# EAGLE design labwiz-module_full_breakout-0.2 (EAGLE 6.5.0)

## Sheet 1 of 2
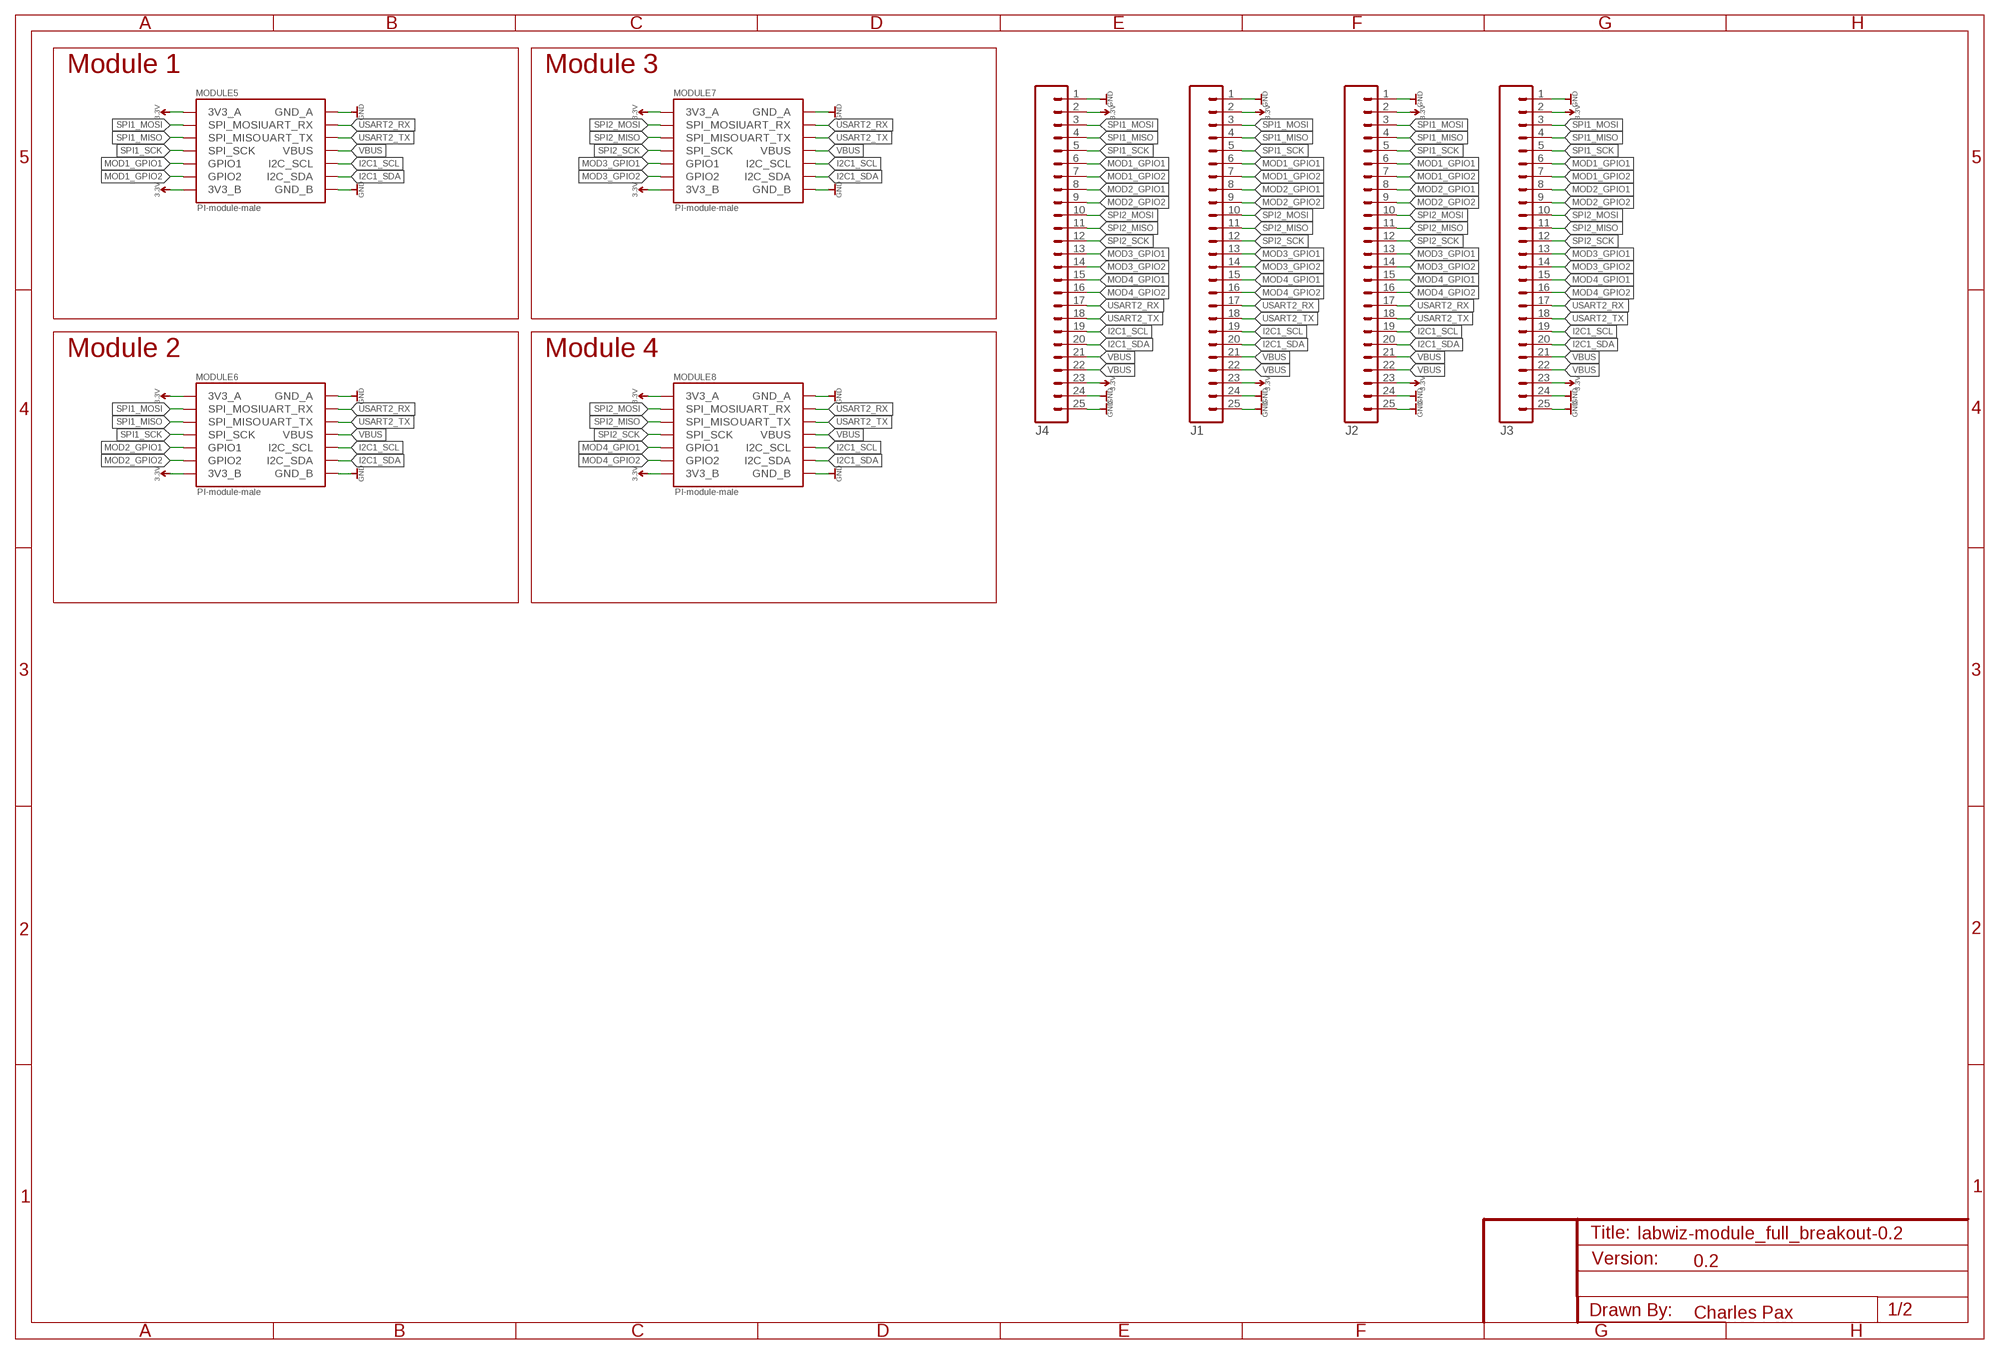
[diagram p0: schematic, sheet 1]

### Parts
J1  M25PTH  [1X25]
J2  M25PTH  [1X25]
J3  M25PTH  [1X25]
J4  M25PTH  [1X25]
MODULE5  PI-module-male  PAX_MODULE_EDGE_MALE_MODULE  [M07X2_2MM_EDGE]
MODULE6  PI-module-male  PAX_MODULE_EDGE_MALE_MODULE  [M07X2_2MM_EDGE]
MODULE7  PI-module-male  PAX_MODULE_EDGE_MALE_MODULE  [M07X2_2MM_EDGE]
MODULE8  PI-module-male  PAX_MODULE_EDGE_MALE_MODULE  [M07X2_2MM_EDGE]

### Nets
3.3V: J1.2 J1.23 J2.2 J2.23 J3.2 J3.23 J4.2 J4.23 MODULE5.P$1(3V3_B) MODULE5.P$13(3V3_A) MODULE6.P$1(3V3_B) MODULE6.P$13(3V3_A) MODULE7.P$1(3V3_B) MODULE7.P$13(3V3_A) MODULE8.P$1(3V3_B) MODULE8.P$13(3V3_A)
GND: J1.1 J1.24 J1.25 J2.1 J2.24 J2.25 J3.1 J3.24 J3.25 J4.1 J4.24 J4.25 MODULE5.P$2(GND_B) MODULE5.P$14(GND_A) MODULE6.P$2(GND_B) MODULE6.P$14(GND_A) MODULE7.P$2(GND_B) MODULE7.P$14(GND_A) MODULE8.P$2(GND_B) MODULE8.P$14(GND_A)
I2C1_SCL: J1.19 J2.19 J3.19 J4.19 MODULE5.P$6(I2C_SCL) MODULE6.P$6(I2C_SCL) MODULE7.P$6(I2C_SCL) MODULE8.P$6(I2C_SCL)
I2C1_SDA: J1.20 J2.20 J3.20 J4.20 MODULE5.P$4(I2C_SDA) MODULE6.P$4(I2C_SDA) MODULE7.P$4(I2C_SDA) MODULE8.P$4(I2C_SDA)
MOD1_GPIO1: J1.6 J2.6 J3.6 J4.6 MODULE5.P$5(GPIO1)
MOD1_GPIO2: J1.7 J2.7 J3.7 J4.7 MODULE5.P$3(GPIO2)
MOD2_GPIO1: J1.8 J2.8 J3.8 J4.8 MODULE6.P$5(GPIO1)
MOD2_GPIO2: J1.9 J2.9 J3.9 J4.9 MODULE6.P$3(GPIO2)
MOD3_GPIO1: J1.13 J2.13 J3.13 J4.13 MODULE7.P$5(GPIO1)
MOD3_GPIO2: J1.14 J2.14 J3.14 J4.14 MODULE7.P$3(GPIO2)
MOD4_GPIO1: J1.15 J2.15 J3.15 J4.15 MODULE8.P$5(GPIO1)
MOD4_GPIO2: J1.16 J2.16 J3.16 J4.16 MODULE8.P$3(GPIO2)
SPI1_MISO: J1.4 J2.4 J3.4 J4.4 MODULE5.P$9(SPI_MISO) MODULE6.P$9(SPI_MISO)
SPI1_MOSI: J1.3 J2.3 J3.3 J4.3 MODULE5.P$11(SPI_MOSI) MODULE6.P$11(SPI_MOSI)
SPI1_SCK: J1.5 J2.5 J3.5 J4.5 MODULE5.P$7(SPI_SCK) MODULE6.P$7(SPI_SCK)
SPI2_MISO: J1.11 J2.11 J3.11 J4.11 MODULE7.P$9(SPI_MISO) MODULE8.P$9(SPI_MISO)
SPI2_MOSI: J1.10 J2.10 J3.10 J4.10 MODULE7.P$11(SPI_MOSI) MODULE8.P$11(SPI_MOSI)
SPI2_SCK: J1.12 J2.12 J3.12 J4.12 MODULE7.P$7(SPI_SCK) MODULE8.P$7(SPI_SCK)
USART2_RX: J1.17 J2.17 J3.17 J4.17 MODULE5.P$12(UART_RX) MODULE6.P$12(UART_RX) MODULE7.P$12(UART_RX) MODULE8.P$12(UART_RX)
USART2_TX: J1.18 J2.18 J3.18 J4.18 MODULE5.P$10(UART_TX) MODULE6.P$10(UART_TX) MODULE7.P$10(UART_TX) MODULE8.P$10(UART_TX)
VBUS: J1.21 J1.22 J2.21 J2.22 J3.21 J3.22 J4.21 J4.22 MODULE5.P$8(VBUS) MODULE6.P$8(VBUS) MODULE7.P$8(VBUS) MODULE8.P$8(VBUS)

### Notes on the sheet
- Module 1 | Module 3
- Module 2 | Module 4
- 0.2
- Charles Pax

## Sheet 2 of 2

## Library data of the parts
J1-J4 = SparkFun-Connectors:M25: 1x25 .1" header
MODULE5-MODULE8 = PaxInstruments-Connectors:PAX_MODULE; MF: Pax Instruments; MPN: PIxxxx

## Net classes
0 Digital signal: width 0.1 mm, drill 0.2 mm, clearance 0.15 mm
1 3.3V power: width 0.1 mm, drill 0.2 mm, clearance 0.15 mm
2 RTC battery: width 0.1 mm, drill 0.2 mm, clearance 0.15 mm
3 5V power: width 0.1 mm, drill 0.2 mm, clearance 0.15 mm
4 Analog signal: width 0.1 mm, drill 0.2 mm, clearance 0.15 mm
5 GND: width 0.1 mm, drill 0.2 mm, clearance 0.15 mm

## Board
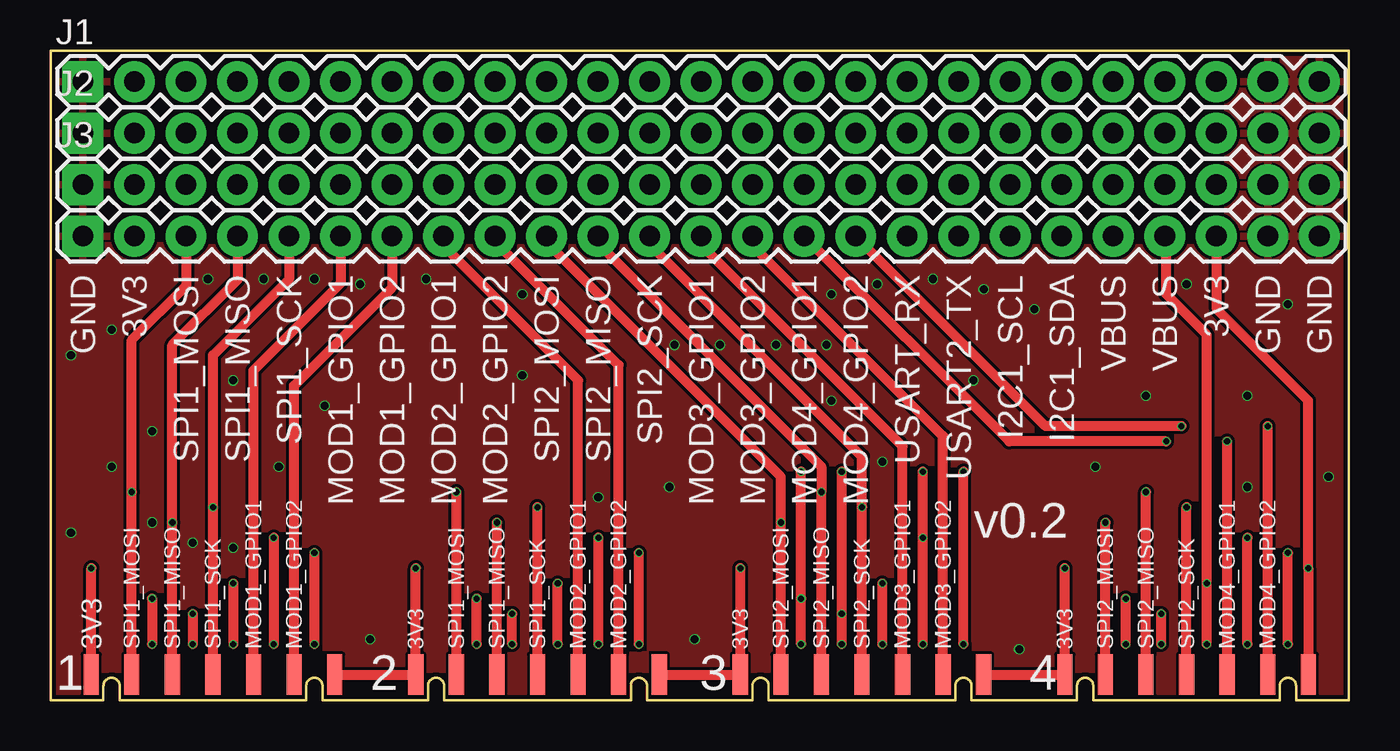
[diagram p1: board, top side]
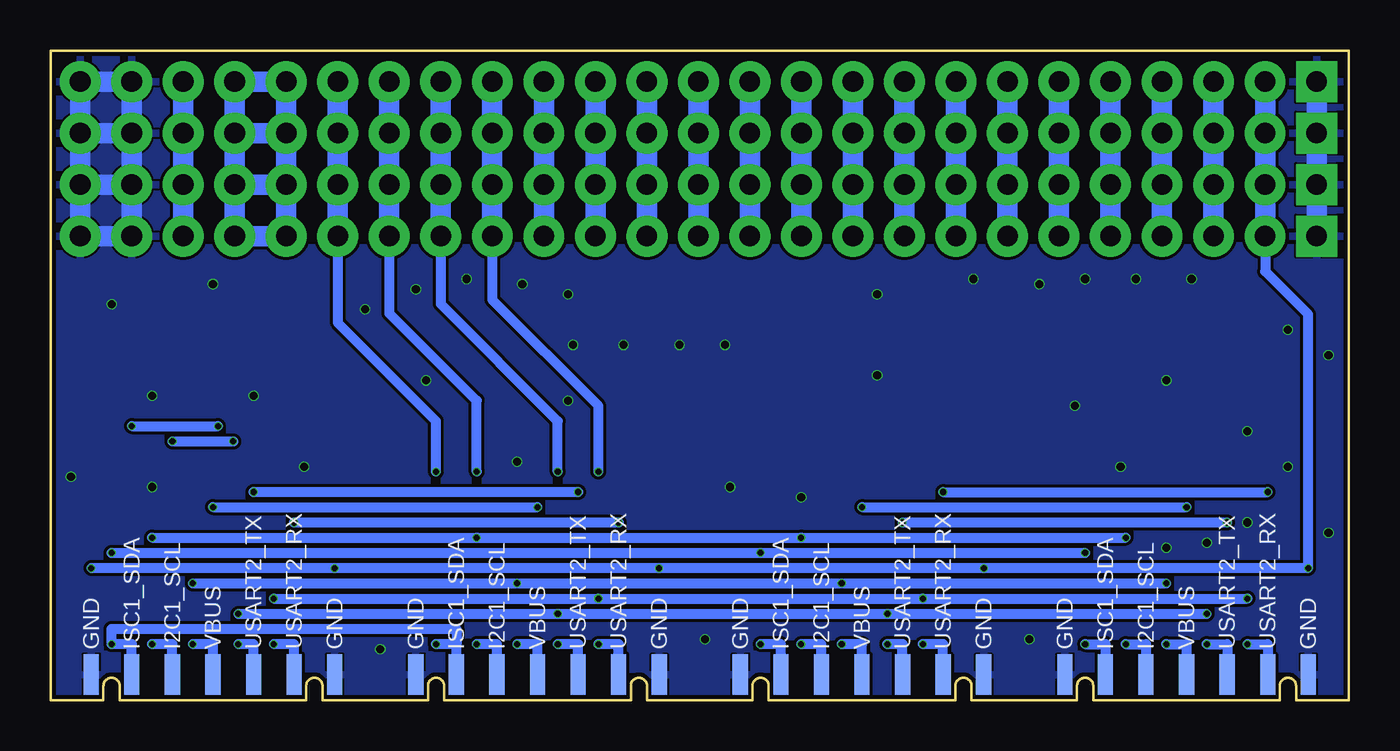
[diagram p2: board, bottom side, seen from below]

Size 64 x 32 mm. Coordinates in mm from the lower left corner, seen from the top.
Outline: 0,32 0,0 2.6,0 2.6,0.7 arc-180 3.4,0.7 3.4,0 12.6,0 12.6,0.7 arc-180 13.4,0.7 13.4,0 18.6,0 18.6,0.7 arc-180 19.4,0.7 19.4,0 28.6,0 28.6,0.7 arc-180 29.4,0.7 29.4,0 34.6,0 34.6,0.7 arc-180 35.4,0.7 35.4,0 44.6,0 44.6,0.7 arc-180 45.4,0.7 45.4,0 50.6,0 50.6,0.7 arc-180 51.4,0.7 51.4,0 60.6,0 60.6,0.7 arc-180 61.4,0.7 61.4,0 64,0 64,32 0,32
Copper layers (1*2+15*16): Top 0.017mm / dielectric 0.5mm / GND 0.017mm / dielectric 0.075mm / 3.3V 0.017mm / dielectric 0.5mm / Bottom 0.017mm
Design rules "PaxInstrument-T400 *": minimum track width 0.1mm, minimum drill 0.2mm, track to track 0.075mm, track to pad 0.075mm, pad to pad 0.075mm, via to via 0.075mm, smd to smd 0.075mm, copper to edge 0.2mm, drill to drill 0.2mm, minimum pad ring 0.5mm, minimum via ring 0.05mm, stop-mask expansion 0.01mm, vias tented up to drill 0.25mm, thermal gap 0.1mm

### Footprints (pad centres in the part's own frame; a part is rotated, then mirrored left to right if it is on the bottom)
1X25 = drill 1.016 pad 1.88 square: 1 0,0 | drill 1.016 pad 1.88: 2 2.54,0; 3 5.08,0; 4 7.62,0; 5 10.16,0; 6 12.7,0; 7 15.24,0; 8 17.78,0; 9 20.32,0; 10 22.86,0; 11 25.4,0; 12 27.94,0; 13 30.48,0; 14 33.02,0; 15 35.56,0; 16 38.1,0; 17 40.64,0; 18 43.18,0; 19 45.72,0; 20 48.26,0; 21 50.8,0; 22 53.34,0; 23 55.88,0; 24 58.42,0; 25 60.96,0
M07X2_2MM_EDGE = smd 0.75 x 2: P$1 0,-0.25; P$3 2,-0.25; P$5 4,-0.25; P$7 6,-0.25; P$9 8,-0.25; P$11 10,-0.25; P$13 12,-0.25 | smd 0.75 x 2 bottom: P$2 0,-0.25; P$4 2,-0.25; P$6 4,-0.25; P$8 6,-0.25; P$10 8,-0.25; P$12 10,-0.25; P$14 12,-0.25

### Placement (x,y rotation side)
J1  1.59,30.48 0 top
J2  1.59,27.94 0 top
J3  1.59,25.4 0 top
J4  1.59,22.86 0 top
MODULE5  14,1 180 top
MODULE6  30,1 180 top
MODULE7  46,1 180 top
MODULE8  62,1 180 top

### Tracks (layer width: path | path; a pad name or v marks a point on that pad's centre or on a via)
3.3V  (via drill 0.3)
  Top 0.5: MODULE5.P$13 v2,6.5 | MODULE8.P$1 v62,6.5 62,14.75 57.5,19.25 57.5,22.83 J4.23 | v18,6.5 MODULE6.P$13 MODULE5.P$1 | MODULE7.P$1 MODULE8.P$13 v50,6.5 | v34,6.5 MODULE7.P$13 MODULE6.P$1
  Bottom 0.5: v62,6.5 v50,6.5 v34,6.5 v18,6.5 v2,6.5 2,19 4.13,21.13 J4.2
  Bottom 1.016: J1.2 J2.2 J3.2 J4.2 | J1.23 J2.23 J3.23 J4.23
GND  (via drill 0.4)
  Bottom 1.016: J2.1 J1.1 J3.1 J4.1 | J2.25 J3.25 J3.24 J4.24 | J1.25 J4.25 J4.24 | J2.24 J1.24 | J1.24 J1.25 | J1.25 J2.25 | J2.25 J2.24 | J2.24 J4.24 | J1.24 J4.24
  other vias: 54,15 59,15 56,20.5 61,19.5 63,11 59,10.5 51.5,11.5 48.5,19.25 46,20.25 43.5,20.75 45.5,15.75 41,11.75 38.5,14.75 35.75,17.5 33,17.5 30.75,17.5 30.5,10.5 23.25,16 13.5,14.5 18.5,20.75 15.25,20.5 13,20.75 10.5,20.75 7.75,20.75 5,13.25 5,8.75 9,15.75 7,7.75 9,7.5 11.25,11.5 3,18.25 3,11.5 1,8.25 1,17 23.25,20 27,10 15.75,3 31.75,3 47.75,2.5 38.25,17.5 38.5,20 40.75,20.5
  pour Bottom: 0,32 -0.25,-0.25 64,0 64,32
  pour Top: 0,32 -0.25,-0.25 64,0 64,32
I2C1_SCL  (via drill 0.3)
  Top 0.5: v43,11.25 v43,2.75 v43,8 | v59,2.75 v59,8 | v11,8 v11,2.75 | v27,2.75 v27,8
  Bottom 0.5: MODULE7.P$6 42,2.75 v43,2.75 | v43,11.25 43,14.75 47.31,19.06 J4.19 | MODULE8.P$6 58,2.75 v59,2.75 | v59,8 v43,8 v27,8 v11,8 | v11,2.75 10,2.75 MODULE5.P$6 | MODULE6.P$6 26,2.75 v27,2.75
  Bottom 1.016: J1.19 J2.19 J3.19 J4.19
I2C1_SDA  (via drill 0.3)
  Top 0.5: v45,2.75 v45,11.25 | v61,2.75 v61,7.25 | v13,7.25 v13,2.75 | v29,2.75 v29,7.25
  Bottom 0.5: MODULE7.P$4 44,2.75 | 44,2.75 v45,2.75 | v45,11.25 45,13.75 49.85,18.6 J4.20 | MODULE8.P$4 60,2.75 v61,2.75 61,3.5 44,3.5 44,2.75 | v61,7.25 v29,7.25 v13,7.25 | v13,2.75 12,2.75 MODULE5.P$4 | MODULE6.P$4 28,2.75 v29,2.75
  Bottom 1.016: J1.20 J2.20 J3.20 J4.20
MOD1_GPIO1
  Top 0.5: MODULE5.P$5 10,16.25 14.29,20.54 J4.6
  Bottom 1.016: J3.6 J2.6 J1.6 J4.6
MOD1_GPIO2
  Top 0.5: MODULE5.P$3 12,15.5 16.83,20.33 J4.7
  Bottom 1.016: J3.7 J2.7 J1.7 J4.7
MOD2_GPIO1
  Top 0.5: MODULE6.P$5 26,15.75 19.37,22.38 J4.8
  Bottom 1.016: J3.8 J2.8 J1.8 J4.8
MOD2_GPIO2
  Top 0.5: MODULE6.P$3 28,16.5 21.91,22.59 J4.9
  Bottom 1.016: J3.9 J2.9 J1.9 J4.9
MOD3_GPIO1
  Top 0.5: MODULE7.P$5 42,12.5 32.07,22.43 J4.13
  Bottom 1.016: J1.13 J2.13 J3.13 J4.13
MOD3_GPIO2
  Top 0.5: MODULE7.P$3 44,13 34.61,22.39 J4.14
  Bottom 1.016: J3.14 J2.14 J1.14 J4.14
MOD4_GPIO1  (via drill 0.3)
  Top 0.5: MODULE8.P$5 v58,12.75 | v55,12.75 47.26,12.75 J4.15
  Bottom 0.5: v58,12.75 v55,12.75
  Bottom 1.016: J2.15 J1.15 J3.15 J4.15
MOD4_GPIO2  (via drill 0.3)
  Top 0.5: MODULE8.P$3 v60,13.5 | v55.75,13.5 49.05,13.5 J4.16
  Bottom 0.5: v60,13.5 v55.75,13.5
  Bottom 1.016: J2.16 J1.16 J3.16 J4.16
SPI1_MISO  (via drill 0.3)
  Top 0.5: MODULE5.P$9 v6,8.75 6,17.5 9.21,20.71 J4.4 | MODULE6.P$9 v22,8.75
  Bottom 0.5: v22,8.75 v6,8.75
  Bottom 1.016: J1.4 J2.4 J3.4 J4.4
SPI1_MOSI  (via drill 0.3)
  Top 0.5: MODULE5.P$11 v4,10.25 4,17.75 6.67,20.42 J4.3 | MODULE6.P$11 v20,10.25
  Bottom 0.5: v20,10.25 v4,10.25
  Bottom 1.016: J2.3 J1.3 J3.3 J4.3
SPI1_SCK  (via drill 0.3)
  Top 0.5: MODULE5.P$7 v8,9.5 8,17 11.75,20.75 J4.5 | MODULE6.P$7 v24,9.5
  Bottom 0.5: v24,9.5 v8,9.5
  Bottom 1.016: J3.5 J2.5 J1.5 J4.5
SPI2_MISO  (via drill 0.3)
  Top 0.5: MODULE7.P$9 v38,10.25 38,11.5 26.99,22.51 J4.11 | MODULE8.P$9 v54,10.25
  Bottom 0.5: v38,10.25 v54,10.25
  Bottom 1.016: J1.11 J2.11 J3.11 J4.11
SPI2_MOSI  (via drill 0.3)
  Top 0.5: MODULE7.P$11 v36,8.75 | v36,8.75 36,11 24.45,22.55 J4.10 | MODULE8.P$11 v52,8.75 | v36,8.75 36,9
  Bottom 0.5: v52,8.75 v36,8.75
  Bottom 1.016: J3.10 J2.10 J1.10 J4.10
SPI2_SCK  (via drill 0.3)
  Top 0.5: MODULE7.P$7 v40,9.5 40,12 29.53,22.47 J4.12 | MODULE8.P$7 v56,9.5
  Bottom 0.5: v56,9.5 v40,9.5
  Bottom 1.016: J1.12 J2.12 J3.12 J4.12
USART2_RX  (via drill 0.3)
  Top 0.5: v37,11.25 v37,5 v37,2.75 | v53,2.75 v53,5 | v5,5 v5,2.75 | v21,2.75 v21,5
  Bottom 0.5: MODULE7.P$12 36,2.75 v37,2.75 | v37,11.25 37,14.5 42.23,19.73 J4.17 | MODULE8.P$12 52,2.75 v53,2.75 | v53,5 v37,5 v21,5 v5,5 | v5,2.75 4,2.75 MODULE5.P$12 | MODULE6.P$12 20,2.75 v21,2.75
  Bottom 1.016: J1.17 J2.17 J3.17 J4.17
USART2_TX  (via drill 0.3)
  Top 0.5: v39,11.25 v39,2.75 v39,4.25 | v54.75,2.75 v54.75,4.25 | v7,4.25 v7,2.75 | v22.75,2.75 v22.75,4.25
  Bottom 0.5: MODULE7.P$10 38,2.75 v39,2.75 | v39,11.25 39,13.75 44.77,19.52 J4.18 | MODULE8.P$10 54,2.75 v54.75,2.75 | v54.75,4.25 v39,4.25 v22.75,4.25 v7,4.25 | v7,2.75 6,2.75 MODULE5.P$10 | MODULE6.P$10 22,2.75 v22.75,2.75
  Bottom 1.016: J1.18 J2.18 J3.18 J4.18
VBUS  (via drill 0.3)
  Top 0.5: v57,2.75 v57,5.75 57,18 55,20 55,22.79 J4.22 | v9,5.75 v9,2.75 | v25,2.75 v25,5.75 | v41,2.75 v41,5.75
  Bottom 0.5: MODULE8.P$8 56,2.75 v57,2.75 | v57,5.75 v41,5.75 v25,5.75 v9,5.75 | v9,2.75 8,2.75 MODULE5.P$8 | MODULE6.P$8 24,2.75 v25,2.75 | MODULE7.P$8 40,2.75 v41,2.75
  Bottom 1.016: J2.21 J1.21 J1.22 J2.22 | J2.21 J3.21 J3.22 J4.22 | J4.22 J4.21 J2.21 | J2.21 J2.22 | J2.22 J4.22

### Text on the board
tPlace: GND | 3V3 | SPI1_MOSI | SPI1_MISO | SPI1_SCK | MOD1_GPIO1 | MOD1_GPIO2 | MOD2_GPIO1 | MOD2_GPIO2 | SPI2_MOSI | SPI2_MISO | SPI2_SCK | MOD3_GPIO1 | MOD3_GPIO2 | MOD4_GPIO1 | MOD4_GPIO2 | USART_RX | USART2_TX | I2C1_SCL | I2C1_SDA | VBUS | VBUS | 3V3 | GND | GND | v0.2 | 3V3 | SPI1_MOSI | SPI1_MISO | SPI1_SCK | MOD1_GPIO1 | MOD1_GPIO2 | 3V3 | SPI1_MOSI | SPI1_MISO | SPI1_SCK | MOD2_GPIO1 | MOD2_GPIO2 | 3V3 | SPI2_MOSI | SPI2_MISO | SPI2_SCK | MOD3_GPIO1 | MOD3_GPIO2 | 3V3 | SPI2_MOSI | SPI2_MISO | SPI2_SCK | MOD4_GPIO1 | MOD4_GPIO2 | 1 | 2 | 3 | 4
bPlace: GND | USART2_RX | USART2_TX | VBUS | I2C1_SCL | ISC1_SDA | GND | GND | USART2_RX | USART2_TX | VBUS | I2C1_SCL | ISC1_SDA | GND | GND | USART2_RX | USART2_TX | VBUS | I2C1_SCL | ISC1_SDA | GND | GND | USART2_RX | USART2_TX | VBUS | I2C1_SCL | ISC1_SDA | GND